# EAGLE design LifiReceiver (EAGLE 8.6.0)
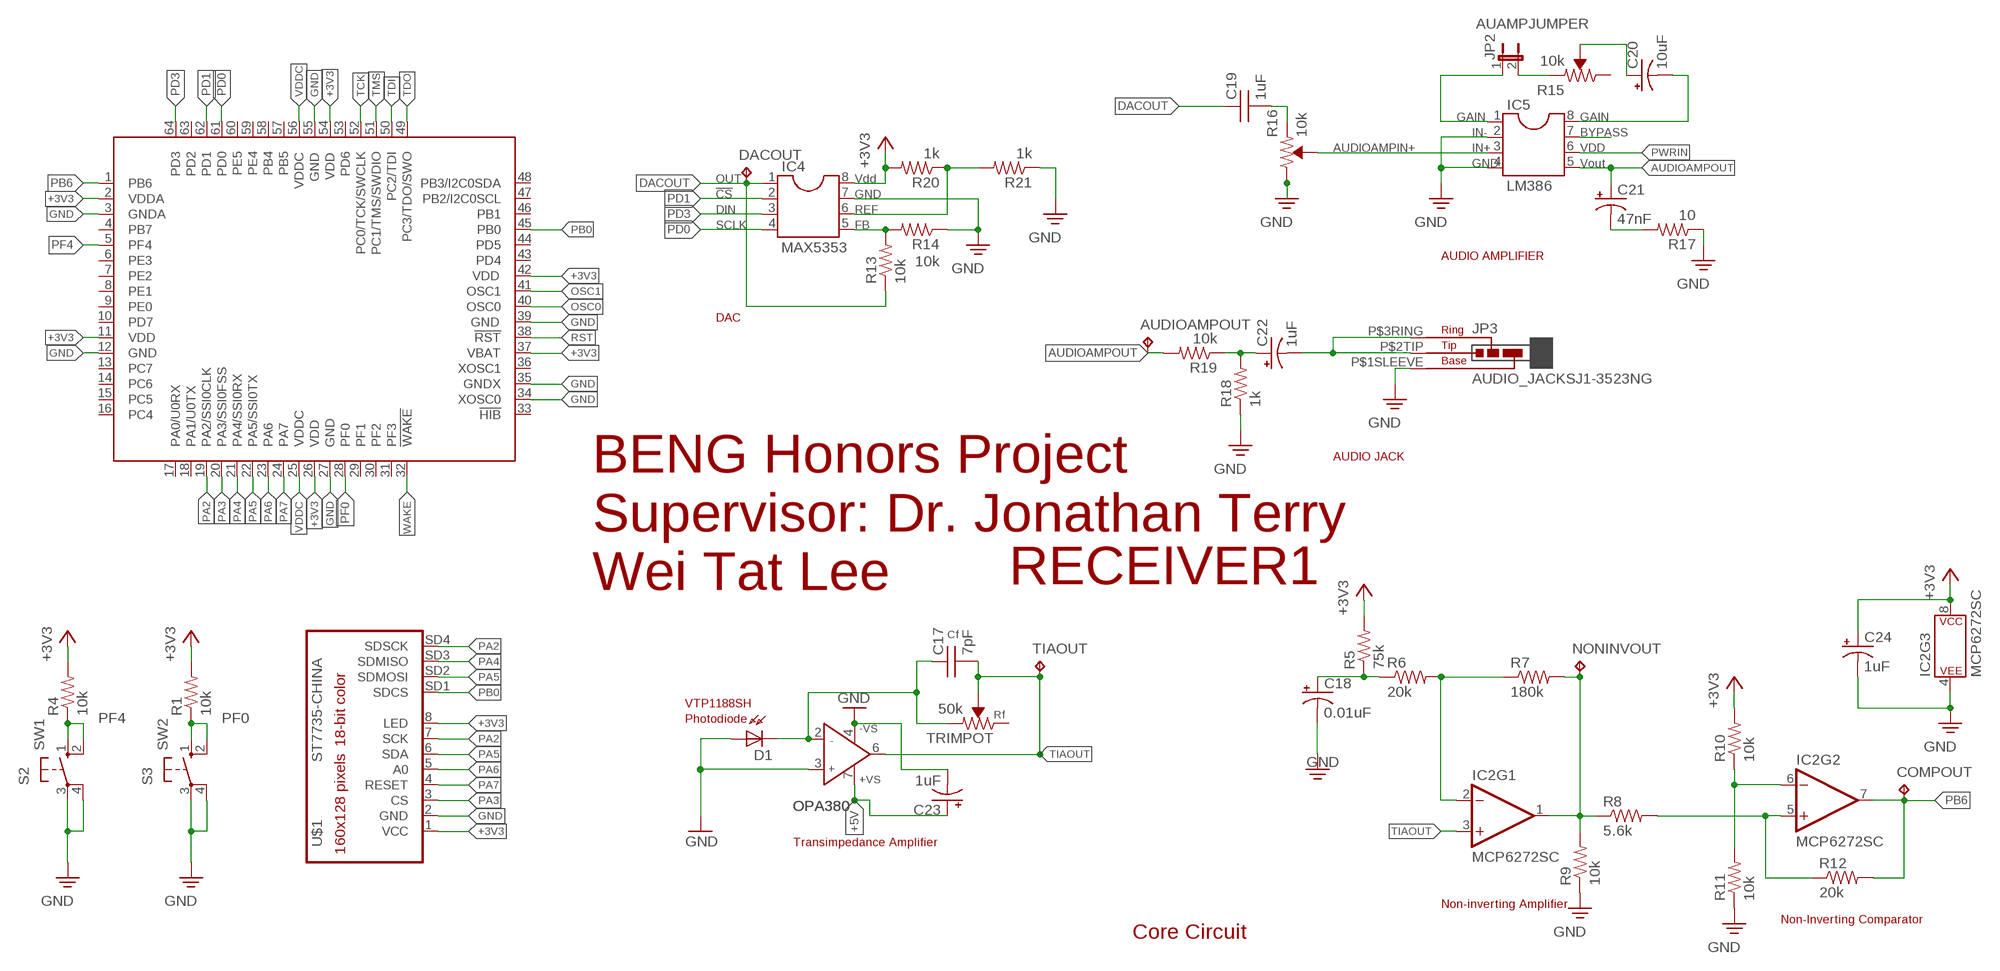
[diagram p0: schematic, sheet 1, part 1 of 2]
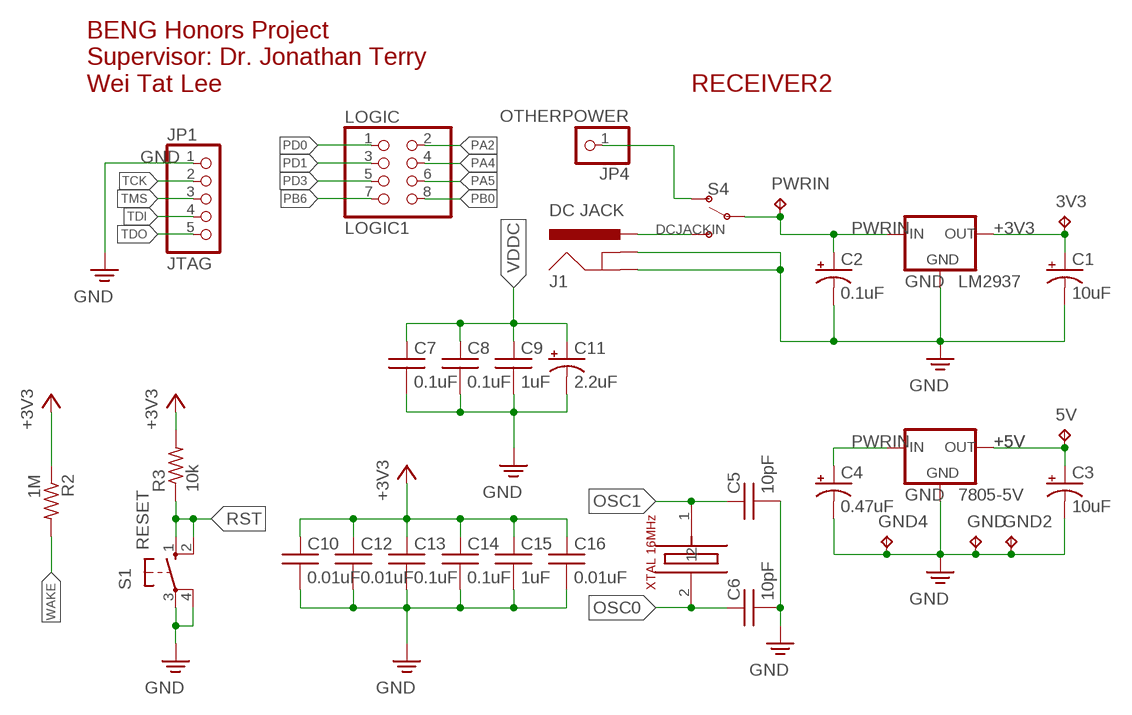
[diagram p1: schematic, sheet 1, part 2 of 2]

## Parts
3V3  TP_KEYSTONE500X  [P1.1MM]
5V  TP_KEYSTONE500X  [P1.1MM]
7805-5V  78XXS  [78XXS]
AUDIOAMPOUT  TP_KEYSTONE500X  [P1.1MM]
C1  10uF  CAPACITOR_POLARIZEDE5-6  [CAP200MILPOLARIZED]
C2  0.1uF  CAPACITOR_POLARIZEDE5-6  [CAP200MILPOLARIZED]
C3  10uF  CAPACITOR_POLARIZEDE5-6  [CAP200MILPOLARIZED]
C4  0.47uF  CAPACITOR_POLARIZEDE5-6  [CAP200MILPOLARIZED]
C5  10pF  CAPACITOR025-024X044  [CAP100MIL]
C6  10pF  CAPACITOR025-024X044  [CAP100MIL]
C7  0.1uF  CAPACITOR025-024X044  [CAP100MIL]
C8  0.1uF  CAPACITOR025-024X044  [CAP100MIL]
C9  1uF  CAPACITOR025-024X044  [CAP100MIL]
C10  0.01uF  CAPACITOR025-024X044  [CAP100MIL]
C11  2.2uF  CAPACITOR_POLARIZEDE5-6  [CAP200MILPOLARIZED]
C12  0.01uF  CAPACITOR025-024X044  [CAP100MIL]
C13  0.1uF  CAPACITOR025-024X044  [CAP100MIL]
C14  0.1uF  CAPACITOR025-024X044  [CAP100MIL]
C15  1uF  CAPACITOR025-024X044  [CAP100MIL]
C16  0.01uF  CAPACITOR025-024X044  [CAP100MIL]
C17  7pF  CAPACITOR050-024X044  [CAP200MIL]
C18  0.01uF  CAPACITOR_POLARIZEDE5-6  [CAP200MILPOLARIZED]
C19  1uF  CAPACITOR050-024X044  [CAP200MIL]
C20  10uF  CAPACITOR_POLARIZEDE5-6  [CAP200MILPOLARIZED]
C21  47nF  CAPACITOR_POLARIZEDE5-6  [CAP200MILPOLARIZED]
C22  1uF  CAPACITOR_POLARIZEDE5-6  [CAP200MILPOLARIZED]
C23  1uF  CAPACITOR_POLARIZEDE5-6  [CAP200MILPOLARIZED]
C24  1uF  CAPACITOR_POLARIZEDE5-6  [CAP200MILPOLARIZED]
COMPOUT  TP_KEYSTONE500X  [P1.1MM]
D1  PHOTODIODE1X02THROUGH  [1X02_LOCK]
DACOUT  TP_KEYSTONE500X  [P1.1MM]
GND  TP_KEYSTONE500X  [P1.1MM]
GND2  TP_KEYSTONE500X  [P1.1MM]
GND4  TP_KEYSTONE500X  [P1.1MM]
IC1  TM4C123[1,3,B]XXPM  [PM_S-PQFP-G64]
IC2  MCP6272SC  [SOCKET-08]
IC4  MAX5353  DIL8S  [SOCKET-08]
IC5  LM386  DIL8S  [SOCKET-08]
J1  DC JACK  POWER_JACKPTH_BREAD  [POWER_JACK_PTH_BREAD]
JP1  JTAG  PINHD-1X5  [1X05]
JP2  AUAMPJUMPER  JUMPER-2PTH  [1X02]
JP3  AUDIO_JACKSJ1-3523NG  [JACK-SJ1-3523NG]
JP4  OTHERPOWER  PINHD-1X1  [1X01]
LM2937  78XXS  [78XXS]
LOGIC  LOGIC1  PINHD-2X4  [2X04]
NONINVOUT  TP_KEYSTONE500X  [P1.1MM]
OPA380  AD820RM  [MSOP08]
PWRIN  TP_KEYSTONE500X  [P1.1MM]
R1  10k  RESISTOR0309/10  [RES400MIL]
R2  1M  RESISTOR0309/10  [RES400MIL]
R3  10k  RESISTOR0309/10  [RES400MIL]
R4  10k  RESISTOR0309/10  [RES400MIL]
R5  75k  RESISTOR0309/10  [RES400MIL]
R6  20k  RESISTOR0309/10  [RES400MIL]
R7  180k  RESISTOR0309/10  [RES400MIL]
R8  5.6k  RESISTOR0309/10  [RES400MIL]
R9  10k  RESISTOR0309/10  [RES400MIL]
R10  10k  RESISTOR0309/10  [RES400MIL]
R11  10k  RESISTOR0309/10  [RES400MIL]
R12  20k  RESISTOR0309/10  [RES400MIL]
R13  10k  RESISTOR0309/10  [RES400MIL]
R14  10k  RESISTOR0309/10  [RES400MIL]
R15  10k  TRIM-SUNTAN3362P  [TRIM-SUNTAN3362P]
R16  10k  TRIM-SUNTAN3362P  [TRIM-SUNTAN3362P]
R17  10  RESISTOR0309/10  [RES400MIL]
R18  1k  RESISTOR0309/10  [RES400MIL]
R19  10k  RESISTOR0309/10  [RES400MIL]
R20  1k  RESISTOR0309/10  [RES400MIL]
R21  1k  RESISTOR0309/10  [RES400MIL]
S1  RESET  B3F-1052  [B3F-10XX]
S2  SW1  B3F-1052  [B3F-10XX]
S3  SW2  B3F-1052  [B3F-10XX]
S4  SWITCH-SPDT-PTH-11.6X4.0MM  [SWITCH_SPDT_PTH_11.6X4.0MM]
TIAOUT  TP_KEYSTONE500X  [P1.1MM]
TRIMPOT  50k  TRIM-SUNTAN3362P  [TRIM-SUNTAN3362P]
U$1  ST7735-CHINA  [ST7735-CHINA]
XTAL  16MHz  XTAL  [XTAL]

## Nets
+3V3: 3V3.TP C1.+ C10.1 C12.1 C13.1 C14.1 C15.1 C16.1 C24.+ IC1.2(VDDA) IC1.11(VDD) IC1.26(VDD) IC1.37(VBAT) IC1.42(VDD) IC1.54(VDD) IC2.8(P$V+) IC4.8 LM2937.OUT R1.2 R2.1 R3.2 R4.2 R5.2 R10.2 R20.2 U$1.1(VCC) U$1.8(LED)
+5V: 5V.TP 7805-5V.OUT C3.+ C23.+ OPA380.7(+VS)
AUAMPJUMP3: JP2.2 R15.P$1(CCW)
AUAMPJUNCT1: C19.2 R16.P$1(CCW)
AUAMPJUNCT2: C21.- R17.2
AUAMPJUNCT4: C20.+ R15.P$2M(WIPER)
AUDIOAMPIN+: IC5.3 R16.P$2M(WIPER)
AUDIOAMPOUT: AUDIOAMPOUT.TP C21.+ IC5.5 R19.2
AUDIOBYPASS: IC5.7
AUJACKJUNCT1: C22.+ R18.2 R19.1
AUJACKRINGTIP: C22.- JP3.P$2TIP(TIP) JP3.P$3RING(RING)
COMPIN-: IC2.5(+IN) R8.2 R12.1
COMPREF: IC2.6(-IN) R10.1 R11.2
DACFB: IC4.5 R13.2 R14.2
DACOUT: C19.1 DACOUT.TP IC4.1 R13.1
DACREF: IC4.6 R20.1 R21.2
DCJACKIN: J1.PWR S4.3(S)
GAIN1: IC5.1 JP2.1
GAIN2: C20.- IC5.8
GND: 7805-5V.GND C1.- C2.- C3.- C4.- C5.2 C6.2 C7.2 C8.2 C9.2 C10.2 C11.- C12.2 C13.2 C14.2 C15.2 C16.2 C18.- C23.- C24.- D1.1+(A) GND2.TP GND4.TP GND.TP IC1.3(GNDA) IC1.12(GND) IC1.27(GND) IC1.34(XOSC0) IC1.35(GNDX) IC1.39(GND) IC1.55(GND) IC2.4(P$V-) IC4.7 IC5.2 IC5.4 J1.GND J1.GNDBREAK JP1.1 JP3.P$1SLEEVE(BASE) LM2937.GND OPA380.3(IN+) OPA380.4(-VS) R9.1 R11.1 R14.1 R16.P$3(CW) R17.1 R18.1 R21.1 S1.3(P) S1.4(P1) S2.3(P) S2.4(P1) S3.3(P) S3.4(P1) U$1.2(GND)
NONINV-: IC2.2(-IN) R6.2 R7.1
NONINVAMPJUNT1: C18.+ R5.1 R6.1
NONINVOUT: IC2.1(OUT) NONINVOUT.TP R7.2 R8.1 R9.2
OSC0: C6.1 IC1.40(OSC0) XTAL.2
OSC1: C5.1 IC1.41(OSC1) XTAL.1
OTHERPOWER: JP4.1 S4.1(O)
PA2: IC1.19(PA2/SSI0CLK) LOGIC.2 U$1.7(SCK) U$1.SD4(SDSCK)
PA3: IC1.20(PA3/SSI0FSS) U$1.3(CS)
PA4: IC1.21(PA4/SSI0RX) LOGIC.4 U$1.SD3(SDMISO)
PA5: IC1.22(PA5/SSI0TX) LOGIC.6 U$1.6(SDA) U$1.SD2(SDMOSI)
PA6: IC1.23(PA6) U$1.5(A0)
PA7: IC1.24(PA7) U$1.4(RESET)
PB0: IC1.45(PB0) LOGIC.8 U$1.SD1(SDCS)
PB6: COMPOUT.TP IC1.1(PB6) IC2.7(OUT) LOGIC.7 R12.2
PD0: IC1.61(PD0) IC4.4 LOGIC.1
PD1: IC1.62(PD1) IC4.2 LOGIC.3
PD3: IC1.64(PD3) IC4.3 LOGIC.5
PF0: IC1.28(PF0) R1.1 S3.1(S) S3.2(S1)
PF4: IC1.5(PF4) R4.1 S2.1(S) S2.2(S1)
PHOTODIODECAT: C17.1 D1.2(C) OPA380.2(IN-) TRIMPOT.P$1(CCW)
PWRIN: 7805-5V.IN C2.+ C4.+ IC5.6 LM2937.IN PWRIN.TP S4.2(P)
RST: IC1.38(!RST) R3.1 S1.1(S) S1.2(S1)
TCK: IC1.52(PC0/TCK/SWCLK) JP1.2
TDI: IC1.50(PC2/TDI) JP1.4
TDO: IC1.49(PC3/TDO/SWO) JP1.5
TIAOUT: C17.2 IC2.3(+IN) OPA380.6(OUT) TIAOUT.TP TRIMPOT.P$2M(WIPER)
TMS: IC1.51(PC1/TMS/SWDIO) JP1.3
VDDC: C7.1 C8.1 C9.1 C11.+ IC1.25(VDDC) IC1.56(VDDC)
WAKE: IC1.32(!WAKE) R2.2
Unconnected: IC1.4(PB7) IC1.6(PE3) IC1.7(PE2) IC1.8(PE1) IC1.9(PE0) IC1.10(PD7) IC1.13(PC7) IC1.14(PC6) IC1.15(PC5) IC1.16(PC4) IC1.17(PA0/U0RX) IC1.18(PA1/U0TX) IC1.29(PF1) IC1.30(PF2) IC1.31(PF3) IC1.33(!HIB) IC1.36(XOSC1) IC1.43(PD4) IC1.44(PD5) IC1.46(PB1) IC1.47(PB2/I2C0SCL) IC1.48(PB3/I2C0SDA) IC1.53(PD6) IC1.57(PB5) IC1.58(PB4) IC1.59(PE4) IC1.60(PE5) IC1.63(PD2) R15.P$3(CW) TRIMPOT.P$3(CW)

## Notes on the sheet
- RECEIVER2
- BENG Honors Project
  Supervisor: Dr. Jonathan Terry
  Wei Tat Lee
- GAIN | GAIN
- IN- | BYPASS
- IN+ | VDD
- GND | Vout
- OUT | Vdd
- !CS | GND
- DIN | REF
- SCLK | FB
- AUDIO AMPLIFIER
- DAC
- AUDIO JACK
- RECEIVER1
- Cf
- BENG Honors Project
  Supervisor: Dr. Jonathan Terry
  Wei Tat Lee
- VTP1188SH
- Rf
- Photodiode
- Transimpedance Amplifier
- Non-inverting Amplifier
- Non-Inverting Comparator
- Core Circuit

## Library data of the parts
3V3 5V AUDIOAMPOUT COMPOUT DACOUT GND GND2 GND4 NONINVOUT PWRIN TIAOUT = EE445L:TP: Test pad Test point, black, Keystone Electronics 5001, Digikey 5001K-ND Test point, orange, Keystone Electronics 5003, Digikey 5003K-ND Test point, yellow, Keystone Electronics 5004, Digikey 5004K-ND Test point, white, Keystone Electronics 5002, Digikey 5002K-ND Test point, red, Keystone Electronics 5000, Digikey 5000K-ND
7805-5V LM2937 = EE445L:78XXS: VOLTAGE REGULATOR 7805, 78M05, LM2937-5.0, LM2937-3.3
C1-C4 C11 C18 C20-C24 = EE445L:CAPACITOR_POLARIZED: POLARIZED CAPACITOR, American symbol
C5-C10 C12-C17 C19 = EE445L:CAPACITOR: CAPACITOR, American symbol
D1 = my-library:PHOTODIODE: PHOTO DIODE
IC1 = ti-tiva:TM4C123[1,3,B]XX: by RobG (430things/43oh/Tindie)
IC2 = my-library:MCP6272: Generic op-amp footprint This component is for the standard 358 pinning of a dual op-amp From the LM358 datasheet: Pin 1: Output A Pin 2: Inverting Input A Pin 3: Non-Inverting Input A Pin 4: Gnd Pin 5: Non-Inverting Input B Pin 6: Inverting Input B Pin 7: Output B Pin 8: V+
IC4 IC5 = ic-package:DIL8: Dual In Line / Socket
J1 = SparkFun-Connectors:POWER_JACK: Power Jack Connector This is the standard 5.5mm barrel jack for power. The PTH is the most common, proven, reliable, footprint. The Slot footprint only works if the mill layer is transmitted to the PCB fab house so be warned. Here are the connectors we sell at SparkFun: DC Barrel Power Jack/Connector <https://www.sparkfun.com/products/119> (PRT-00119) DC Barrel Power Jack/Connector (SMD) <https://www.sparkfun.com/products/12748> (PRT-12748) DC Barrel Jack Adapter - Breadboard Compatible <https://www.sparkfun.com/products/10811> (PRT-10811) It is used on this SparkFun product (and many, many others): SparkFun RedBoard - Programmed with Arduino <https://www.sparkfun.com/products/12757> (DEV-12757) Also, if you need a mating power supply or connector, please check these out: Wall Adapter Power Supply - 9VDC 650mA <https://www.sparkfun.com/products/298> (TOL-00298) DC Barrel Jack Adapter - Male <https://www.sparkfun.com/products/10287> (PRT-10287); PROD_ID: PRT-10811
JP1 = pinhead:PINHD-1X5: PIN HEADER
JP2 = SparkFun-Retired:JUMPER-2: Jumper Basic 0.1" spaced jumper. Use with breakaway headers.
JP3 = my-library:AUDIO_JACK: Audio Jack Accepts a 3.5mm plug
JP4 = EE445L:PINHD-1X1: PIN HEADER
LOGIC = EE445L:PINHD-2X4: PIN HEADER
OPA380 = analog-devices:AD820: Single-Supply, Rail-to-Rail, Low Power, FET Input Op Amp Source: http://www.analog.com/static/imported-files/data_sheets/AD820.pdf; MF: ALTERA CORPORATION; MPN: OPA380; OC_FARNELL: 9426469; OC_NEWARK: 88H0196; SPICEPREFIX: X
R1-R14 R17-R21 = EE445L:RESISTOR: RESISTOR, American symbol
R15 R16 TRIMPOT = my-library:TRIM-SUNTAN3362P
S1-S3 = EE445L:B3F-1052: OMRON SWITCH 1.1mm holes; MPN: B3F-1000; OC_FARNELL: 176432; OC_NEWARK: 36M3542
S4 = SparkFun-Switches:SWITCH-SPDT: Single Pole, Double Throw (SPDT) Switch Single-pole, double-throw (SPDT) switch. Variant Overview SMD-AYZ0202 Surface Mount DPDT Switch <https://www.sparkfun.com/products/597> (COM-00597) Used on e.g. LilyPad Arduino USB - ATmega32U4 Board <https://www.sparkfun.com/products/12049> PTH-11.6X4.0MM SPDT Mini Power Switch <https://www.sparkfun.com/products/102> (COM-00102) Used on e.g. SparkFun Simon Says - Through-Hole Soldering Kit <https://www.sparkfun.com/products/10547> (KIT-10547) PTH-11.6X4.0MM-KIT KIT version of SPDT Mini Power Switch - Simplifies soldering by removing tStop of switch pins - only one side can be soldered. PTH-11.6X4.0MM-LOCK LOCK version of SPDT Mini Power Switch - Offset pins hold switch in place for easier soldering. SMD-RIGHT-ANGLE Surface Mount Right Angle Switch <https://www.sparkfun.com/products/10860> (COM-10860) Used on e.g. SparkFun ESP8266 Thing <https://www.sparkfun.com/products/13231>; PROD_ID: SWCH-08261; SF_SKU: COM-00102
U$1 = my-library:ST7735-CHINA
XTAL = LEE:XTAL: NX5032GAcrystal XTAL

## Board
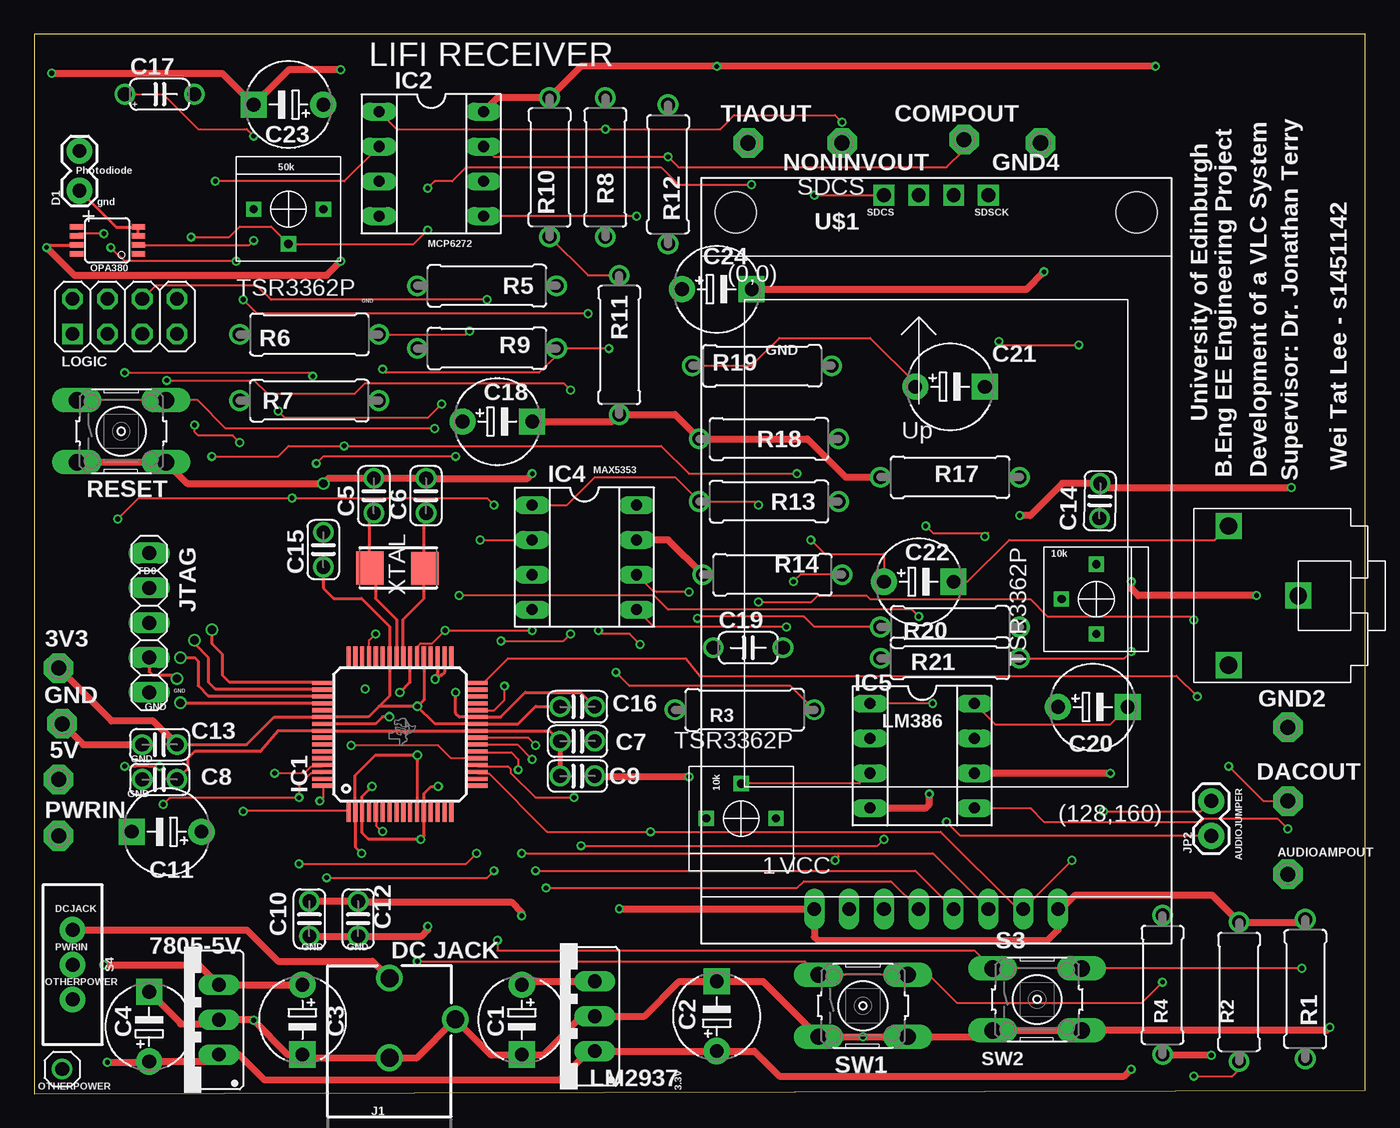
[diagram p2: board, top side]
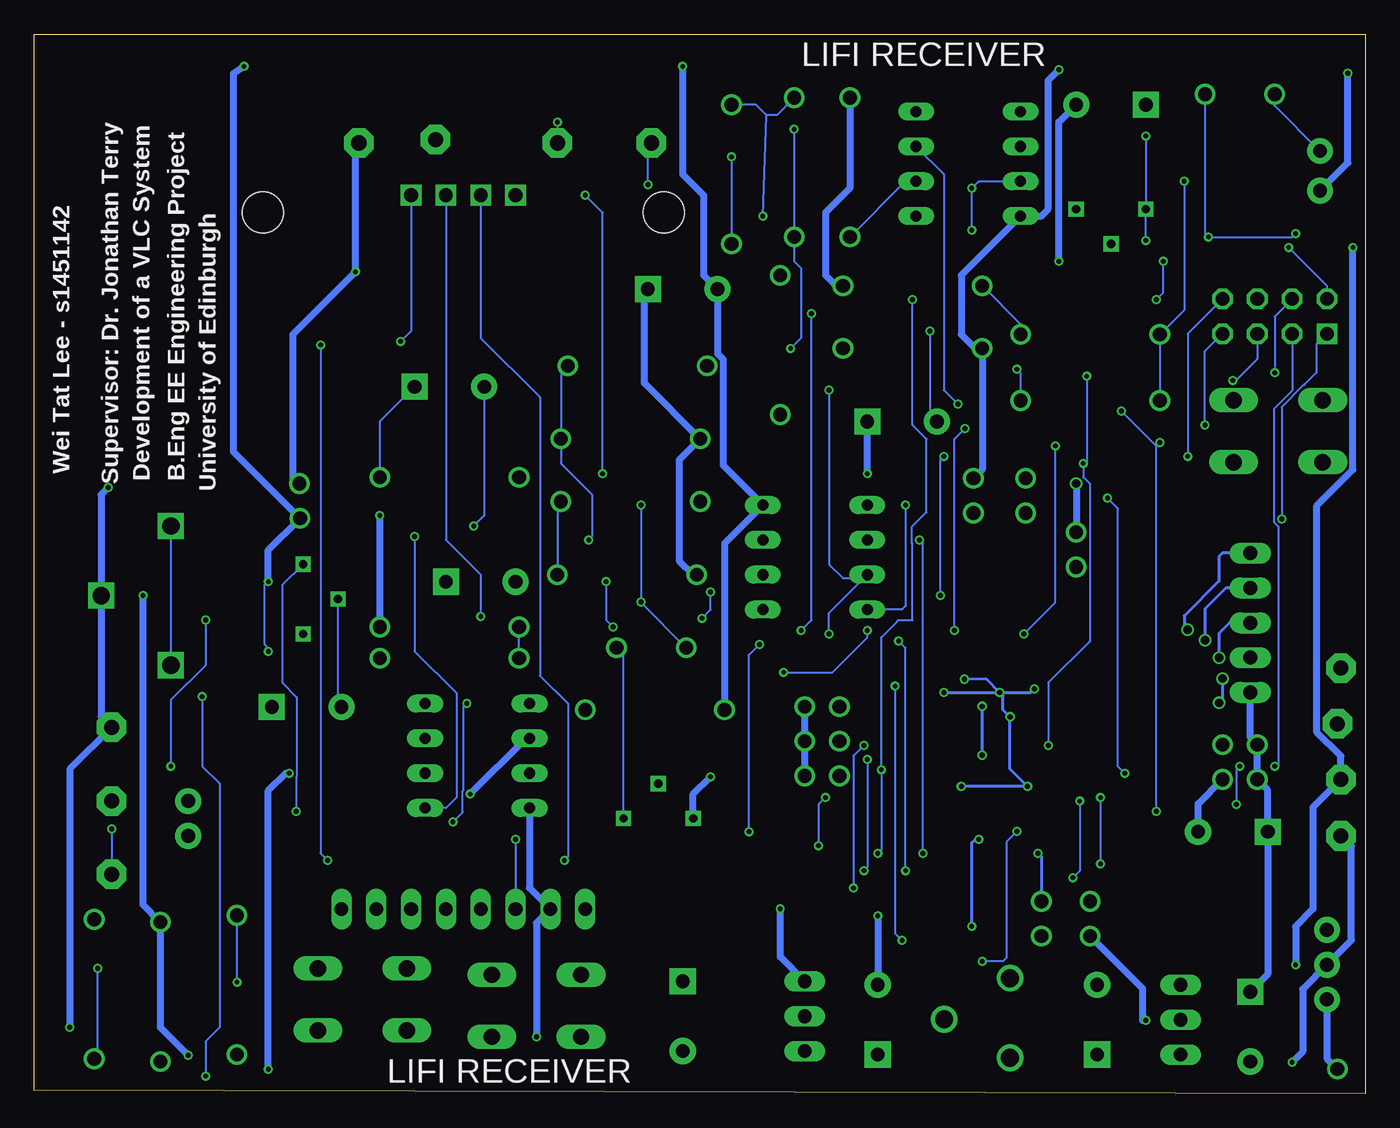
[diagram p3: board, bottom side, seen from below]

Size 97.08 x 77.27 mm. Coordinates in mm from the lower left corner, seen from the top.
Outline: 0,0 97.08,0.25 97.08,77.27 0,77.27 0,0
Copper layers (1*16): Top 0.035mm / dielectric 1.5mm / Bottom 0.035mm
Design rules "SeeedStudio_2layer_DRU_no_angle_20140221": minimum track width 6mil, minimum drill 12mil, track to track 6mil, track to pad 6mil, pad to pad 6mil, via to via 6mil, smd to smd 0mil, copper to edge 10mil, drill to drill 10mil, minimum pad ring 10mil, minimum via ring 6mil, stop-mask expansion 2mil, vias tented up to drill 100mil, thermal gap 10mil

### Footprints (pad centres in the part's own frame; a part is rotated, then mirrored left to right if it is on the bottom)
P1.1MM = drill 1.1 pad 2.159 octagon: TP 0,0
78XXS = drill 1 long: GND 0,-2.54; IN -2.54,-2.54; OUT 2.54,-2.54
CAP200MILPOLARIZED = drill 1 pad 1.905: + -2.54,0 | drill 1 pad 1.905 square: - 2.54,0
CAP100MIL = drill 1: 1 -1.27,0; 2 1.27,0
CAP200MIL = drill 1: 1 -2.54,0; 2 2.54,0
1X02_LOCK = drill 1 pad 1.88: 1+ -0.178,0; 2 2.718,0
PM_S-PQFP-G64 = smd 1.6 x 0.3: 1 -5.6,3.75; 2 -5.6,3.25; 3 -5.6,2.75; 4 -5.6,2.25; 5 -5.6,1.75; 6 -5.6,1.25; 7 -5.6,0.75; 8 -5.6,0.25; 9 -5.6,-0.25; 10 -5.6,-0.75; 11 -5.6,-1.25; 12 -5.6,-1.75; 13 -5.6,-2.25; 14 -5.6,-2.75; 15 -5.6,-3.25; 16 -5.6,-3.75; 33 5.6,-3.75; 34 5.6,-3.25; 35 5.6,-2.75; 36 5.6,-2.25; 37 5.6,-1.75; 38 5.6,-1.25; 39 5.6,-0.75; 40 5.6,-0.25; 41 5.6,0.25; 42 5.6,0.75; 43 5.6,1.25; 44 5.6,1.75; 45 5.6,2.25; 46 5.6,2.75; 47 5.6,3.25; 48 5.6,3.75 | smd 0.3 x 1.6: 17 -3.75,-5.6; 18 -3.25,-5.6; 19 -2.75,-5.6; 20 -2.25,-5.6; 21 -1.75,-5.6; 22 -1.25,-5.6; 23 -0.75,-5.6; 24 -0.25,-5.6; 25 0.25,-5.6; 26 0.75,-5.6; 27 1.25,-5.6; 28 1.75,-5.6; 29 2.25,-5.6; 30 2.75,-5.6; 31 3.25,-5.6; 32 3.75,-5.6; 49 3.75,5.6; 50 3.25,5.6; 51 2.75,5.6; 52 2.25,5.6; 53 1.75,5.6; 54 1.25,5.6; 55 0.75,5.6; 56 0.25,5.6; 57 -0.25,5.6; 58 -0.75,5.6; 59 -1.25,5.6; 60 -1.75,5.6; 61 -2.25,5.6; 62 -2.75,5.6; 63 -3.25,5.6; 64 -3.75,5.6
SOCKET-08 = drill 0.813 long: 1 -3.81,-3.81; 2 -1.27,-3.81; 3 1.27,-3.81; 4 3.81,-3.81; 5 3.81,3.81; 6 1.27,3.81; 7 -1.27,3.81; 8 -3.81,3.81
POWER_JACK_PTH_BREAD = drill 1.3: GND 0,7.9; GNDBREAK 4.8,10.7; PWR 0,13.7
1X05 = drill 1.016 long: 1 -5.08,0; 2 -2.54,0; 3 0,0; 4 2.54,0; 5 5.08,0
1X02 = drill 1.016 pad 1.88: 1 0,0; 2 2.54,0
JACK-SJ1-3523NG = drill 1.27 square: P$1SLEEVE -5.08,0; P$2TIP 0,5.08; P$3RING 0,-5.08
1X01 = drill 1: 1 0,0
2X04 = drill 1 square: 1 -3.81,-1.27 | drill 1 octagon: 2 -3.81,1.27; 3 -1.27,-1.27; 4 -1.27,1.27; 5 1.27,-1.27; 6 1.27,1.27; 7 3.81,-1.27; 8 3.81,1.27
MSOP08 = smd 0.4 x 1: 1 -0.976,-2.263; 2 -0.326,-2.263; 3 0.324,-2.263; 4 0.974,-2.263; 5 0.974,2.262; 6 0.324,2.262; 7 -0.326,2.262; 8 -0.976,2.262
RES400MIL = drill 1: 1 -5.08,0; 2 5.08,0
TRIM-SUNTAN3362P = drill 0.6 pad 0.61 square: P$1 1.27,3.81; P$2M 3.81,1.27; P$3 6.35,3.81
B3F-10XX = drill 1.2 long: 1 -3.251,2.261; 2 3.251,2.261; 3 -3.251,-2.261; 4 3.251,-2.261
SWITCH_SPDT_PTH_11.6X4.0MM = drill 1.016 pad 1.88: 1 0,2.54; 2 0,0; 3 0,-2.54
ST7735-CHINA = drill 1 long: 1 -7.62,-30.48; 2 -5.08,-30.48; 3 -2.54,-30.48; 4 0,-30.48; 5 2.54,-30.48; 6 5.08,-30.48; 7 7.62,-30.48; 8 10.16,-30.48 | drill 1 square: SD1 -2.54,21.59; SD2 0,21.59; SD3 2.54,21.59; SD4 5.08,21.59 | hole 3: -13.335,20.32; 15.875,20.32
XTAL = smd 2 x 2.4: 1 -6.007,0.046; 2 -1.982,0.034

### Placement (x,y rotation side)
3V3  1.78,31.04 0 top
5V  1.78,22.91 180 top
7805-5V  10.92,5.38 90 top
AUDIOAMPOUT  91.44,16 0 top
C1  35.56,5.38 270 top
C2  49.78,5.64 90 top
C3  19.56,5.38 270 top
C4  8.38,4.88 90 top
C5  24.77,43.61 90 top
C6  28.57,43.61 90 top
C7  39.62,25.7 0 top
C8  9.14,22.91 180 top
C9  39.62,23.16 0 top
C10  20.07,12.75 270 top
C11  9.65,19.1 180 top
C12  23.62,12.75 270 top
C13  9.14,25.45 180 top
C14  77.72,43.23 88.8 top
C15  21.08,39.67 90 top
C16  39.62,28.22 0 top
C17  9.14,72.9 0 top
C18  33.78,49.02 0 top
C19  52.07,32.51 0 top
C20  77.22,28.19 0 top
C21  66.8,51.56 0 top
C22  64.52,37.34 0 top
C23  18.54,72.14 180 top
C24  49.78,58.67 0 top
COMPOUT  67.82,69.6 0 top
D1  3.3,66.04 90 top
DACOUT  91.44,21.34 0 top
GND  2.03,26.97 0 top
GND2  91.44,26.72 0 top
GND4  73.41,69.34 0 top
IC1  26.67,26.21 90 top
IC2  28.96,67.82 270 top
IC4  40.13,39.12 270 top
IC5  64.77,24.64 270 top
J1  25.91,-5.28 0 top
JP1  8.38,34.34 90 top
JP2  85.85,18.8 90 top
JP3  87.12,36.32 180 top
JP4  2.03,1.78 0 top
LM2937  38.35,5.64 90 top
LOGIC  6.6,56.69 0 top
NONINVOUT  58.93,69.34 0 top
OPA380  5.33,62.23 90 top
PWRIN  1.78,18.8 0 top
R1  92.71,7.62 90 top
R2  87.88,7.42 270 top
R3  51.82,27.99 180 top
R4  82.3,7.92 270 top
R5  33.02,58.93 0 top
R6  20.07,55.37 180 top
R7  20.07,50.55 0 top
R8  41.66,67.56 90 top
R9  33.02,54.36 0 top
R10  37.59,67.56 90 top
R11  42.67,54.61 90 top
R12  46.23,67.06 270 top
R13  53.59,43.18 0 top
R14  53.85,37.85 0 top
R15  73.66,39.88 270 top
R16  55.37,23.88 180 top
R17  66.8,44.96 0 top
R18  53.59,47.75 0 top
R19  53.09,53.09 180 top
R20  66.8,31.75 0 top
R21  66.8,34.04 180 top
S1  6.35,48.31 0 top
S2  60.45,6.4 0 top
S3  73.15,6.86 0 top
S4  2.79,9.4 180 top
TIAOUT  52.07,69.34 0 top
TRIMPOT  14.73,60.71 0 top
U$1  64.52,43.94 0 top
XTAL  30.48,38.28 0 top

### Tracks (layer width: path | path; a pad name or v marks a point on that pad's centre or on a via)
+3V3  (via drill 0.35, 0.38 pad 0.18)
  Top 0.152: R20.2 79.5,31.75 v80.01,32.26
  Top 0.203: C15.1 21.08,36.88 21.84,36.12 23.88,36.12 25.91,34.09 25.91,31.82 IC1.42 25.92,29.02 25.15,28.24 | 25.15,28.24 24.38,27.48 21.09,27.48 IC1.54 17.51,27.46 15.49,25.45 C13.1 | IC1.11 27.94,20.63 v27.94,24.69 24.89,24.69 23.42,23.22 IC1.2 23.42,17.98 v23.88,17.53 | v27.94,28.24 25.15,28.24 | v27.94,28.24 29.22,26.96 IC1.26 35.29,26.96 36.58,28.24 38.33,28.24 C16.1 | IC1.37 28.42,28.72 v27.94,28.24 | C12.1 23.67,13.97 | 35.56,13.21 v35.56,12.95
  Top 0.508: C13.1 8.69,27.18 5.64,27.18 3V3.TP | C12.1 C10.1 | 23.67,13.97 34.8,13.97 35.56,13.21 | C1.+ 35.81,8.18 LM2937.OUT | v42.67,13.46 U$1.1 56.9,11.43 57.15,11.18 73.91,11.18 74.68,11.94 U$1.8 74.93,13.46 75.95,14.48 85.9,14.48 R2.1 92.51,12.5 R1.2 | v85.85,2.79 82.35,2.79 R4.2 | v89.15,36.32 80.52,36.32 80.01,36.83 v80.01,37.34 | v81.79,74.93 v49.78,74.93 39.88,74.93 R10.2 33.78,72.64 IC2.8
  Bottom 0.152: v80.01,32.26 80.01,32.51 80.26,32.77 80.26,37.08 v80.01,37.34
  Bottom 0.203: v27.94,24.69 v27.94,28.24 | v23.88,17.53 23.62,17.27 C12.1
  Bottom 0.508: v35.56,12.95 C1.+ | LM2937.OUT 42.67,9.96 v42.67,13.46 | v85.85,2.79 87.88,4.83 R2.1 89.15,13.77 v89.15,36.32 | v80.01,37.34 80.01,39.65 C14.1 82.55,46.81 82.55,74.42 v81.79,74.93 | R10.2 37.59,66.04 39.37,64.26 39.37,59.69 38.61,58.93 R5.2 | v49.78,74.93 49.78,67.06 48.26,65.53 48.26,59.69 C24.+ 47.24,53.97 46.85,53.57 46.85,45.83 IC4.8 46.74,40.13 R3.2
+5V  (via drill 0.35)
  Top 0.203: v0.89,61.72 1.07,61.9 OPA380.7
  Top 0.508: v5.08,9.4 11.99,9.4 7805-5V.OUT C3.+ | v0.89,61.72 2.92,59.69 21.34,59.69 v22.35,60.71
  Bottom 0.508: v5.08,9.4 5.08,12.19 3.81,13.46 3.81,20.88 5V.TP 1.78,24.62 3.52,26.36 3.52,42.88 0.89,45.51 v0.89,61.72 | v22.35,60.71 22.35,70.87 C23.+
AUAMPJUMP3  (via drill 0.35)
  Top 0.152: v77.98,20.57 85.09,20.57 JP2.2
  Bottom 0.152: R15.P$1 78.99,37.08 78.99,29.97 77.93,28.91 77.93,23.14 77.98,23.09 v77.98,20.57
AUAMPJUNCT1
  Bottom 0.152: R16.P$1 54.1,32 C19.2
AUAMPJUNCT2
  Bottom 0.152: C21.- 71.88,49.02 R17.2
AUAMPJUNCT4
  Bottom 0.152: C20.+ 74.93,28.45 R15.P$2M
AUDIOAMPIN+
  Top 0.152: IC5.3 60.2,22.61 R16.P$2M
AUDIOAMPOUT  (via drill 0.35)
  Top 0.152: R19.2 52.32,53.09 54.36,55.12 60.96,55.12 64.26,51.82 C21.+ | v65.02,41.4 65.53,40.89 69.6,40.89 v69.34,40.64 | IC5.5 72.64,20.83 73.66,19.81 85.09,19.81 85.34,20.07 90.68,20.07 v91.44,19.3
  Bottom 0.152: C21.+ 64.26,42.16 v65.02,41.4 | v69.34,40.64 69.34,32.26 66.29,29.21 66.29,21.59 67.06,20.83 IC5.5 | v91.44,19.3 AUDIOAMPOUT.TP
AUJACKJUNCT1  (via drill 0.35)
  Top 0.152: v56.64,40.39 57.66,39.37 61.98,39.37 C22.+
  Bottom 0.152: R19.1 58.67,52.58 R18.2 58.67,45.97 56.39,43.69 56.39,40.64 v56.64,40.39
AUJACKRINGTIP
  Top 0.152: C22.- 68.07,37.34 71.12,40.39 86.11,40.39 JP3.P$3RING
  Bottom 0.152: JP3.P$3RING JP3.P$2TIP
COMPIN-  (via drill 0.35)
  Top 0.152: v43.94,64.01 IC2.5
  Bottom 0.152: v43.94,64.01 43.69,71.37 | 43.69,71.37 44.45,72.14 R12.1 | R8.2 42.93,71.37 43.69,71.37
COMPREF
  Top 0.152: R10.1 40.39,59.69 R11.2
  Bottom 0.152: R10.1 33.53,66.55 IC2.6
DACFB  (via drill 0.35)
  Top 0.152: R14.2 55.88,37.85 v55.37,37.34 | v54.86,34.04 45.21,34.04 IC4.5
  Bottom 0.152: R13.2 58.93,42.93 R14.2 | v55.37,37.34 55.37,34.54 v54.86,34.04
DACOUT  (via drill 0.35)
  Top 0.152: IC4.1 38.86,42.93 40.89,44.96 46.74,44.96 R13.1 52.58,43.18 v52.83,42.93 | v52.83,35.86 56.69,35.86 57.15,36.32 60.71,36.32 60.96,36.07 72.64,36.07 73.91,34.8 84.33,34.8 v84.58,34.54 | v87.12,23.88 89.66,21.34 DACOUT.TP
  Bottom 0.152: v52.83,42.93 v52.83,35.86 52.83,35.81 C19.1 | v84.58,34.54 84.58,31.24 87.12,28.7 v87.12,23.88
DACREF  (via drill 0.35)
  Top 0.152: R21.2 56.9,34.04 56.13,34.8 48.51,34.8 v48.39,34.67 48.26,34.54 | v47.75,36.58 45.39,36.58 45.34,36.63 45.16,36.63 IC4.6
  Bottom 0.152: v48.39,34.67 47.75,35.31 v47.75,36.58 | R20.1 R21.2
DCJACKIN
  Top 0.508: S4.3 15.49,11.94 17.78,9.65 24.67,9.65 J1.PWR 26.16,8.16 26.16,7.87
GAIN1  (via drill 0.35)
  Top 0.152: JP2.1 67.56,18.8 v66.55,19.81 | v65.53,28.45 IC5.1
  Bottom 0.152: v66.55,19.81 65.83,20.53 65.83,22.07 65.79,22.12 65.79,28.19 v65.53,28.45
GAIN2
  Top 0.152: IC5.8 70.1,26.92 78.49,26.92 C20.-
GND  (via drill 0.35, 0.38 pad 0.18, 0.6)
  Top 0.203: v24.64,22.4 23.92,21.68 IC1.3 23.92,19.01 24.38,18.54 v28.19,18.54 28.45,18.8 28.45,20.07 28.42,20.09 IC1.12 28.45,20.64 28.45,21.89 28.96,22.4 v29.46,22.4 | v25.91,27.48 25.4,27.48 24.89,26.97 21.08,26.97 IC1.55 | v26.67,29.26 27.43,30.02 27.43,31.8 IC1.39 | v30.73,29.26 30.73,27.74 31.01,27.46 IC1.27 34.02,27.46 35.81,29.26 39.85,29.26 C16.2 | IC1.35 29.42,30.74 v29.23,30.22 29.72,30.53 29.92,30.73 IC1.34 | D1.1+ 5.96,63.2 OPA380.4 OPA380.3
  Top 0.508: C4.- 10.67,5.13 10.67,5.08 13.16,5.08 7805-5V.GND 15.95,5.38 v16,5.33 18.49,2.84 C3.- 19.79,2.62 J1.GND 27.91,2.62 J1.GNDBREAK 33.28,2.84 C1.- 37.13,2.84 39.93,5.64 LM2937.GND 44.5,5.64 47.04,8.18 C2.- 53.16,8.18 S2.3 v60.45,4.14 S2.4 69.44,4.14 S3.3 S3.4 94.26,4.6 v94.49,4.83 | IC5.4 65.02,20.83 65.28,21.08 v65.28,21.84 | GND.TP 3.56,25.45 C13.2 | C10.2 C12.2 28.24,11.48 28.7,11.94 v28.7,12.19 | S1.3 S1.4 11.15,44.5 v21.08,44.5 21.46,44.88 C5.2 C6.2 35.99,44.88 v36.32,45.21 | C18.- 42.16,49.02 R11.1 46.74,49.53 R18.1 56.39,47.75 59.18,44.96 R17.1 | v91.69,44.2 78.05,44.2 C14.2 74.98,44.5 72.64,42.16 v71.88,42.16 | v22.35,74.68 18.54,74.68 C23.- 13.72,74.42 v1.27,74.42 | R14.1 46.23,40.39 IC4.7 | v47.75,23.11 40.94,23.11 C9.2 | C24.- 72.39,58.67 v73.66,59.94
  Bottom 0.203: v29.46,22.4 v24.64,22.4 25.91,23.67 v25.91,27.48 26.42,27.99 26.42,29.01 v26.67,29.26 | v30.73,29.26 v26.67,29.26 | v29.23,30.22 27.69,30.28 v26.67,29.26 | v26.67,29.26 24.38,29.26 v24.13,29.51 | v28.7,12.19 28.7,18.29 28.45,18.54 v28.19,18.54
  Bottom 0.508: C16.2 C7.2 C9.2 | v21.08,44.5 C15.2 | v60.45,4.14 60.45,12.45 U$1.2 60.96,14.99 IC5.4 | v65.28,21.84 61.21,25.91 IC5.2 | C4.- 7.11,8.69 C11.- 7.11,22.15 C8.2 C13.2 8.38,25.96 JP1.1 | C10.2 16.26,7.67 16.26,5.33 v16,5.33 | v36.32,45.21 C18.- | v91.69,44.2 92.2,43.69 JP3.P$1SLEEVE 92.2,27.48 GND2.TP 94.49,23.67 v94.49,4.83 | C6.2 27.94,45.52 R9.1 28.45,54.36 29.46,55.37 29.46,59.69 IC2.4 23.62,64.01 23.11,64.52 23.11,73.91 v22.35,74.68 | D1.1+ 1.27,67.89 v1.27,74.42 | GND4.TP 73.66,69.09 v73.66,59.94 78.23,55.37 78.23,44.45 77.8,44.45 C14.2 | R14.1 49.02,37.85 50.04,38.86 50.04,46.23 R18.1 52.58,51.82 52.58,58.42 C24.- | R16.P$3 49.02,21.84 v47.75,23.11 | v71.88,42.16 R21.1
NONINV-  (via drill 0.35)
  Top 0.152: IC2.2 22.61,66.55 v13.21,66.55
  Bottom 0.152: R7.1 R6.2 13.21,57.15 v13.21,66.55
NONINVAMPJUNT1  (via drill 0.35)
  Top 0.152: R6.1 31.5,55.37 v31.75,55.63
  Bottom 0.152: R5.1 25.15,56.13 R6.1 | v31.75,55.63 31.75,49.53 C18.+
NONINVOUT  (via drill 0.35)
  Top 0.152: IC2.1 26.42,70.36 v41.66,70.36 50.04,70.36 51.05,71.37 58.42,71.37 v58.93,70.87 | v41.91,54.36 R9.2 38.1,53.85 36.83,52.58 25.65,52.58 v25.4,52.83
  Bottom 0.152: v41.66,70.36 R8.1 41.66,60.71 41.15,60.2 41.15,55.12 v41.91,54.36 | v25.4,52.83 25.15,52.58 R7.2 | v58.93,70.87 NONINVOUT.TP
OSC0
  Top 0.203: IC1.40 26.92,34.59 28.45,36.12 28.45,38.26 XTAL.2 28.5,38.35 28.45,38.4 28.45,42.21 C6.1
OSC1
  Top 0.203: XTAL.1 24.89,38.32 24.89,38.15 | 24.89,38.15 24.89,36.12 26.42,34.59 IC1.41 | XTAL.1 24.72,38.32 24.89,38.15 | XTAL.1 24.47,42.05 C5.1
OTHERPOWER
  Bottom 0.508: S4.1 2.79,2.54 JP4.1
PA2  (via drill 0.35)
  Top 0.152: v70.36,54.86 70.61,54.61 v76.2,54.61 | v75.69,17.02 U$1.7 71.74,13.46 66.1,19.1 v44.96,19.1 37.41,19.1 33.16,23.34 32.39,23.34 IC1.19 | v44.2,32.77 43.43,33.53 41.15,33.53 v41.15,33.78 | v40.39,56.9 16.26,56.9 v15.24,57.91 | v14.73,60.71 6.6,60.71 v5.59,61.72
  Bottom 0.152: U$1.SD4 69.6,55.63 v70.36,54.86 | v76.2,54.61 76.2,17.53 v75.69,17.02 | v44.96,19.1 44.96,32 v44.2,32.77 | v41.15,33.78 40.39,34.54 v40.39,56.9 | v15.24,57.91 14.73,58.42 v14.73,60.71 14.73,60.96 | v5.59,61.72 2.79,58.93 LOGIC.2
PA3  (via drill 0.35)
  Top 0.152: IC1.20 32.36,23.88 34.54,23.88 34.75,23.67 34.75,23.39 36.55,21.59 v39.37,21.59 | v39.88,18.08 61.52,18.08 v61.98,18.54
  Bottom 0.152: v39.37,21.59 39.88,21.08 v39.88,18.08 39.88,18.03 | v61.98,18.54 U$1.3
PA4  (via drill 0.35)
  Top 0.152: IC1.21 30.4,24.46 29.46,25.4 v23.11,25.4 | v64.52,34.8 64.01,35.31 46.23,35.31 45.21,36.32 v30.99,36.32 | v30.73,46.48 21.08,46.48 v20.57,45.97 | v6.6,52.58 20.07,52.58 v20.32,52.32
  Bottom 0.152: v23.11,25.4 23.11,29.97 20.1,32.99 20.1,44.48 20.57,44.96 20.57,45.72 | U$1.SD3 67.06,40.39 64.52,37.85 v64.52,34.8 | v30.99,36.32 30.99,46.23 v30.73,46.48 | v20.57,45.97 20.57,45.72 | LOGIC.4 6.6,56.69 v6.6,52.58 | v20.32,52.32 20.32,45.97 20.57,45.72
PA5  (via drill 0.35)
  Top 0.152: IC1.22 32.34,24.89 34.8,24.89 35.31,24.38 v35.31,23.62 | v35.56,17.53 58.67,17.53 | 58.67,17.53 65.53,17.53 U$1.6 | v58.42,17.02 58.67,17.27 58.67,17.53 | v33.02,57.91 17.27,57.91 16.24,58.95 8.86,58.95 LOGIC.6
  Bottom 0.152: v35.56,17.53 35.31,17.78 v35.31,23.62 35.31,33.27 34.16,34.42 34.04,34.54 33.02,34.54 33.02,40.11 33.07,40.16 33.07,41.35 32,42.42 32,47.75 33.02,48.77 v33.02,57.91 | U$1.SD2 64.52,55.12 60.2,50.8 60.2,30.48 58.17,28.45 58.17,17.27 v58.42,17.02
PA6  (via drill 0.35)
  Top 0.152: IC1.23 35.24,25.46 v36.32,24.38 | v36.58,16.26 64.26,16.26 U$1.5
  Bottom 0.152: v36.32,24.38 36.32,16.51 v36.58,16.26
PA7  (via drill 0.35)
  Top 0.152: IC1.24 36.01,25.96 v36.58,25.4 | v37.34,14.99 55.63,14.99 56.13,15.49 62.48,15.49 U$1.4
  Bottom 0.152: v36.58,25.4 37.34,24.64 v37.34,14.99
PB0  (via drill 0.35)
  Top 0.152: IC1.45 24.42,33.06 v24.89,33.53 | v55.63,45.21 47.75,45.21 45.72,47.24 v22.61,47.24 18.54,47.24 17.78,46.48 v12.95,46.48 | v56.9,65.53 U$1.SD1
  Bottom 0.152: v24.89,33.53 22.61,35.81 v22.61,47.24 | v55.63,45.21 55.63,64.26 v56.9,65.53 | LOGIC.8 12.95,55.42 v12.95,46.48
PB6  (via drill 0.35)
  Top 0.152: IC1.1 15.46,20.61 15.24,20.83 v15.24,20.57 | v14.99,47.5 14.48,48.01 11.94,48.01 11.68,48.26 v11.68,48.77 | IC2.7 33.53,68.33 v46.23,68.33 46.99,67.56 66.55,67.56 67.82,68.83 COMPOUT.TP | v29.72,50.29 28.7,49.28 18.29,49.28 v17.78,49.78
  Bottom 0.152: v15.24,20.57 15.24,47.24 | 15.24,47.24 v14.99,47.5 | v11.68,48.77 11.68,54.15 LOGIC.7 | v46.23,68.33 R12.2 | IC2.7 30.73,67.06 30.73,51.31 v29.72,50.29 | v17.78,49.78 15.24,47.24
PD0  (via drill 0.35)
  Top 0.152: IC1.61 20.95,23.84 20.18,23.84 19.7,23.37 v17.53,23.37 | v33.53,42.93 33.02,43.43 v18.8,43.43 7.62,43.43 v6.1,41.91
  Bottom 0.152: v17.53,23.37 18.03,23.88 18.03,42.67 v18.8,43.43 | v33.53,42.93 33.53,35.56 33.78,35.31 IC4.4 | LOGIC.1 3.56,54.66 3.56,52.58 4.43,51.7 4.47,51.7 6.1,50.07 v6.1,41.91
PD1  (via drill 0.35)
  Top 0.152: IC1.62 20.95,23.34 20.18,23.34 19.3,22.47 v19.3,21.59 9.91,21.59 v9.4,21.08 | v19.3,16.76 31.5,16.76 v32.26,17.53 | v32.51,40.39 IC4.2 | v6.6,23.88 7.45,23.88 7.47,23.89 8.28,23.89 8.3,23.88 v9.14,23.88
  Bottom 0.152: v19.3,21.59 v19.3,16.76 | v32.26,17.53 32.26,40.13 v32.51,40.39 | LOGIC.3 5.33,51.26 6.65,49.95 6.65,41.68 6.35,41.38 6.35,23.88 v6.6,23.88 | v9.14,23.88 9.4,23.62 v9.4,21.08
PD3  (via drill 0.35)
  Top 0.152: IC1.64 21.07,21.58 v20.83,21.34 | v21.34,15.75 33.02,15.75 v33.53,16.26 | v34.04,33.02 38.61,33.02 v39.12,33.53 | v9.65,52.02 16.05,52.02 17.02,51.05 23.37,51.05 24.13,51.82 38.61,51.82 v39.12,51.31
  Bottom 0.152: v20.83,21.34 20.83,16.26 v21.34,15.75 | v33.53,16.26 33.53,32.51 v34.04,33.02 | v39.12,33.53 39.12,35.05 36.58,37.59 | 36.58,37.59 IC4.3 | LOGIC.5 7.87,53.59 9.45,52.02 v9.65,52.02 | v39.12,51.31 39.12,38.61 38.1,37.59 36.58,37.59
PF0  (via drill 0.35)
  Top 0.152: IC1.28 33.55,27.96 34.29,28.7 v34.29,29.72 | v33.78,11.18 33.78,10.41 68.61,10.41 S3.1 S3.2 76.43,9.14 v92.46,9.14
  Bottom 0.152: v34.29,29.72 34.29,11.68 v33.78,11.18 | R1.1 92.46,2.79 v92.46,9.14
PF4  (via drill 0.35)
  Top 0.152: IC1.5 24.92,19.53 25.15,19.3 25.22,19.3 v25.4,19.12 | v27.94,9.65 56.21,9.65 S2.1 S2.2 65.25,8.66 67.31,6.6 80.77,6.6 v82.3,8.13
  Bottom 0.152: v25.4,19.12 26.16,18.36 26.16,9.91 26.42,9.65 v27.94,9.65 | v82.3,8.13 R4.1
PHOTODIODECAT  (via drill 0.35)
  Top 0.152: OPA380.2 15.68,61.9 v16,62.23 | C17.1 9.4,72.9 11.94,70.36 15.49,70.36 v16,69.85
  Bottom 0.152: v16,62.23 TRIMPOT.P$1 v16,69.85 | D1.2 6.6,72.06 C17.1
PWRIN  (via drill 0.35)
  Top 0.508: v5.33,2.29 8.33,2.29 C4.+ 12.95,2.34 7805-5V.IN 14.94,2.84 16.76,1.02 38.35,1.02 40.44,3.1 LM2937.IN C2.+ 52.53,3.1 54.36,1.27 79.5,1.27 v80.01,1.78 | v78.49,23.37 IC5.6
  Bottom 0.508: v5.33,2.29 4.57,3.05 4.57,7.62 S4.2 1.02,11.18 1.02,18.03 PWRIN.TP | v80.01,1.78 80.01,22.1 78.74,23.37 v78.49,23.37
RST  (via drill 0.35)
  Top 0.152: R3.1 55.17,29.72 43.43,29.72 v42.42,30.73 | v36.32,33.78 v29.97,33.78 29.03,32.84 28.18,32.84 27.92,32.59 IC1.38 | v29.21,48.51 13.97,48.51 11.91,50.57 S1.2 S1.1
  Bottom 0.152: v42.42,30.73 38.86,30.73 36.32,33.27 v36.32,33.78 | v29.97,33.78 29.97,47.75 v29.21,48.51
TCK  (via drill 0.6)
  Top 0.203: JP1.2 8.38,30.78 8.64,30.53 10.16,30.53 v10.41,30.28 | v10.67,28.5 21.03,28.5 IC1.52
  Bottom 0.203: v10.41,30.28 10.41,28.75 v10.67,28.5
TDI  (via drill 0.6)
  Top 0.203: v11.68,33.07 11.68,32.82 12.7,31.8 12.7,30.02 13.21,29.51 21.02,29.51 IC1.50
  Bottom 0.203: JP1.4 10.16,36.88 11.68,35.36 v11.68,33.07
TDO  (via drill 0.6)
  Top 0.203: v12.95,33.83 12.95,32.82 13.72,32.05 13.72,30.53 14.22,30.02 21.01,30.02 IC1.49
  Bottom 0.203: JP1.5 10.41,39.42 10.67,39.17 10.67,37.39 13.21,34.85 13.21,34.09 v12.95,33.83
TIAOUT  (via drill 0.35)
  Top 0.152: v11.43,62.48 14.22,62.48 14.99,63.25 17.27,63.25 TRIMPOT.P$2M 27.69,61.98 v28.7,62.99 | v5.08,62.74 3.26,62.74 OPA380.6 | v52.32,66.29 46.99,66.29 45.72,67.56 31.5,67.56 30.48,66.55 29.21,66.55 v28.7,66.04
  Bottom 0.152: C17.2 11.68,62.74 v11.43,62.48 5.33,62.48 v5.08,62.74 | v28.7,62.99 v28.7,66.04 28.19,66.55 IC2.3 | v52.32,66.29 52.32,69.09 TIAOUT.TP
TMS  (via drill 0.6)
  Top 0.203: v10.67,31.8 11.68,31.8 11.94,31.55 11.94,29.77 12.7,29.01 21.03,29.01 IC1.51
  Bottom 0.203: JP1.3 9.91,34.34 10.67,33.58 v10.67,31.8
VDDC
  Top 0.203: C7.1 37.6,26.46 IC1.25 IC1.56 17.78,26.46 16.51,24.94 11.68,24.94 11.18,24.43 11.18,23.67 C8.1
  Top 0.381: C7.1 C9.1
  Bottom 0.508: C11.+ 12.19,21.13 C8.1
WAKE  (via drill 0.35)
  Top 0.152: IC1.32 32.76,29.96 34.54,31.75 47.5,31.75 48.51,30.48 83.31,30.48 v84.84,28.96 | v84.58,1.27 87.38,1.27 87.88,1.78 R2.2
  Bottom 0.152: v84.84,28.96 84.84,23.88 83.57,22.61 83.57,4.83 84.58,3.81 v84.58,1.27

### Text on the board
tNames: LIFI RECEIVER | + | University of Edinburgh | 50k | Photodiode | gnd | SDCS | SDSCK | MCP6272 | OPA380 | GND | GND | MAX5353 | Wei Tat Lee - s1451142 | B.Eng EE Engineering Project | Development of a VLC System | Supervisor: Dr. Jonathan Terry | TD0 | 10k | GND | GND | LM386 | GND | GND | 10k | AUDIOJUMPER | DCJACK | PWRIN | GND | GND | OTHERPOWER | SW2 | 3.3V | OTHERPOWER
bNames: LIFI RECEIVER | B.Eng EE Engineering Project | Development of a VLC System | Supervisor: Dr. Jonathan Terry | Wei Tat Lee - s1451142 | University of Edinburgh | LIFI RECEIVER